# Altium schematic sheet Relay Control.SchDoc
size A4; SheetNumber: 6; SheetTotal: 7
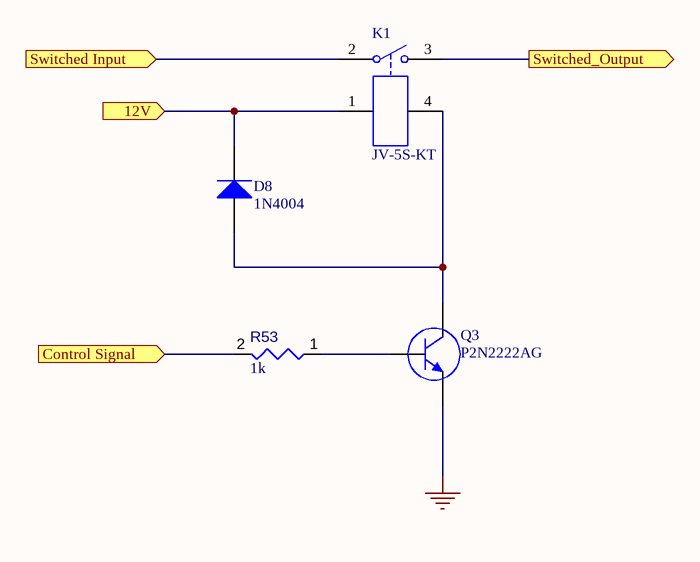
[diagram p0: Relay Control.SchDoc]

## Parts
D8  1N4004  [FAIR-DO-41-2]
K1  JV-5S-KT  [FJSU-JV-5S-KT_V]
Q3  P2N2222AG  [ONSC-TO-92-3-29-11]
R53  value 1k  [RESA60-630X240]  (hidden comment: MFR-25FBF52-1K)

## Ports
12V (in), Control Signal (in), Switched Input (in), Switched_Output (out)

## Nets
GND: Q3.1(E)
12V: D8.2(K) K1.1 ; port 12V
Control Signal: R53.2 ; port Control Signal
Switched Input: K1.2 ; port Switched Input
Switched_Output: K1.3 ; port Switched_Output
NetD8_1: D8.1(A) K1.4 Q3.3(C)
NetQ3_2: Q3.2(B) R53.1

## Library data of the parts
D8 = CMP-004-00004-2: General Purpose Rectifier, 400 V, 1 A, -55 to 175 degC, 2-Pin DO-204AL (DO-41), RoHS, Tape and Reel; Manufacturer: Fairchild Semiconductor; Forward Voltage: 1.1V; Forward Current: 1A; Max Surge Current: 30A; Package Version: Rev. 2, 09/2008; Peak Reverse Current: 50A; Case/Package: DO-41-2; Pins: 2; RoHS Compliant: True; Diameter: 2.72mm; Package Reference: DO-41-2; Datasheet URL: https://www.fairchildsemi.com/datasheets/1N/1N4004.pdf; Manufacturer URL: https://www.fairchildsemi.com/; Max Operating Temperature: 175°C; Datasheet Version: Rev. 1.1.0, 11/2014; Package URL: http://www.fairchildsemi.com/dwg/DO/DO41A.pdf; Package Quantity: 5000; Min Operating Temperature: -55°C; Package Description: 2-Pin Axial Lead, Dia 2.375 mm, Body Length 4.63 mm; Mounting Technology: TH; Packaging: TapeandReel
K1 = CMP-008-00001-4: Power Relay, 5 A, 125 Ohm, -40 to 70 degc, 4-Pin THD, RoHS; Manufacturer: Fujitsu; Contact Form: SPST; Current Rating: 5A; Operate Time: 8ms; Datasheet URL: http://www.fujitsu.com/downloads/MICRO/fcai/relays/jv.pdf; Max Operating Temperature: 70°C; Pins: 4; Datasheet Version: Apr-12; RoHS Compliant: True; Mounting Technology: ThroughHole; Min Operating Temperature: -40°C; Package Reference: JV-5S-KT; Package Description: 4-Pin Through Hole Device, Body 17.5 x 10 mm, Picth 15.24 mm
Q3 = CMP-013-00036-1: Small Signal Bipolar Transistor, 0.6A I(C), 40V V(BR)CEO, 1-Element, NPN, Silicon, TO-92; Frequency: 300MHz; Pins: 3; Max Operating Temperature: 150°C; RoHS Compliant: Yes
R53 = CMP-009-00195-1: Fixed Resistor, Metal Film, 0.25W, 1000ohm, 250V, 1% +/-Tol, 100ppm/Cel, Through Hole Mount; Power: 250mW; Tolerance: 1%; RoHS Compliant: Yes; Min Operating Temperature: -55°C; Max Operating Temperature: 155°C; Mounting Technology: Through Hole; Pins: 2